# Altium schematic sheet quality&usage_monitor.SchDoc
size A2
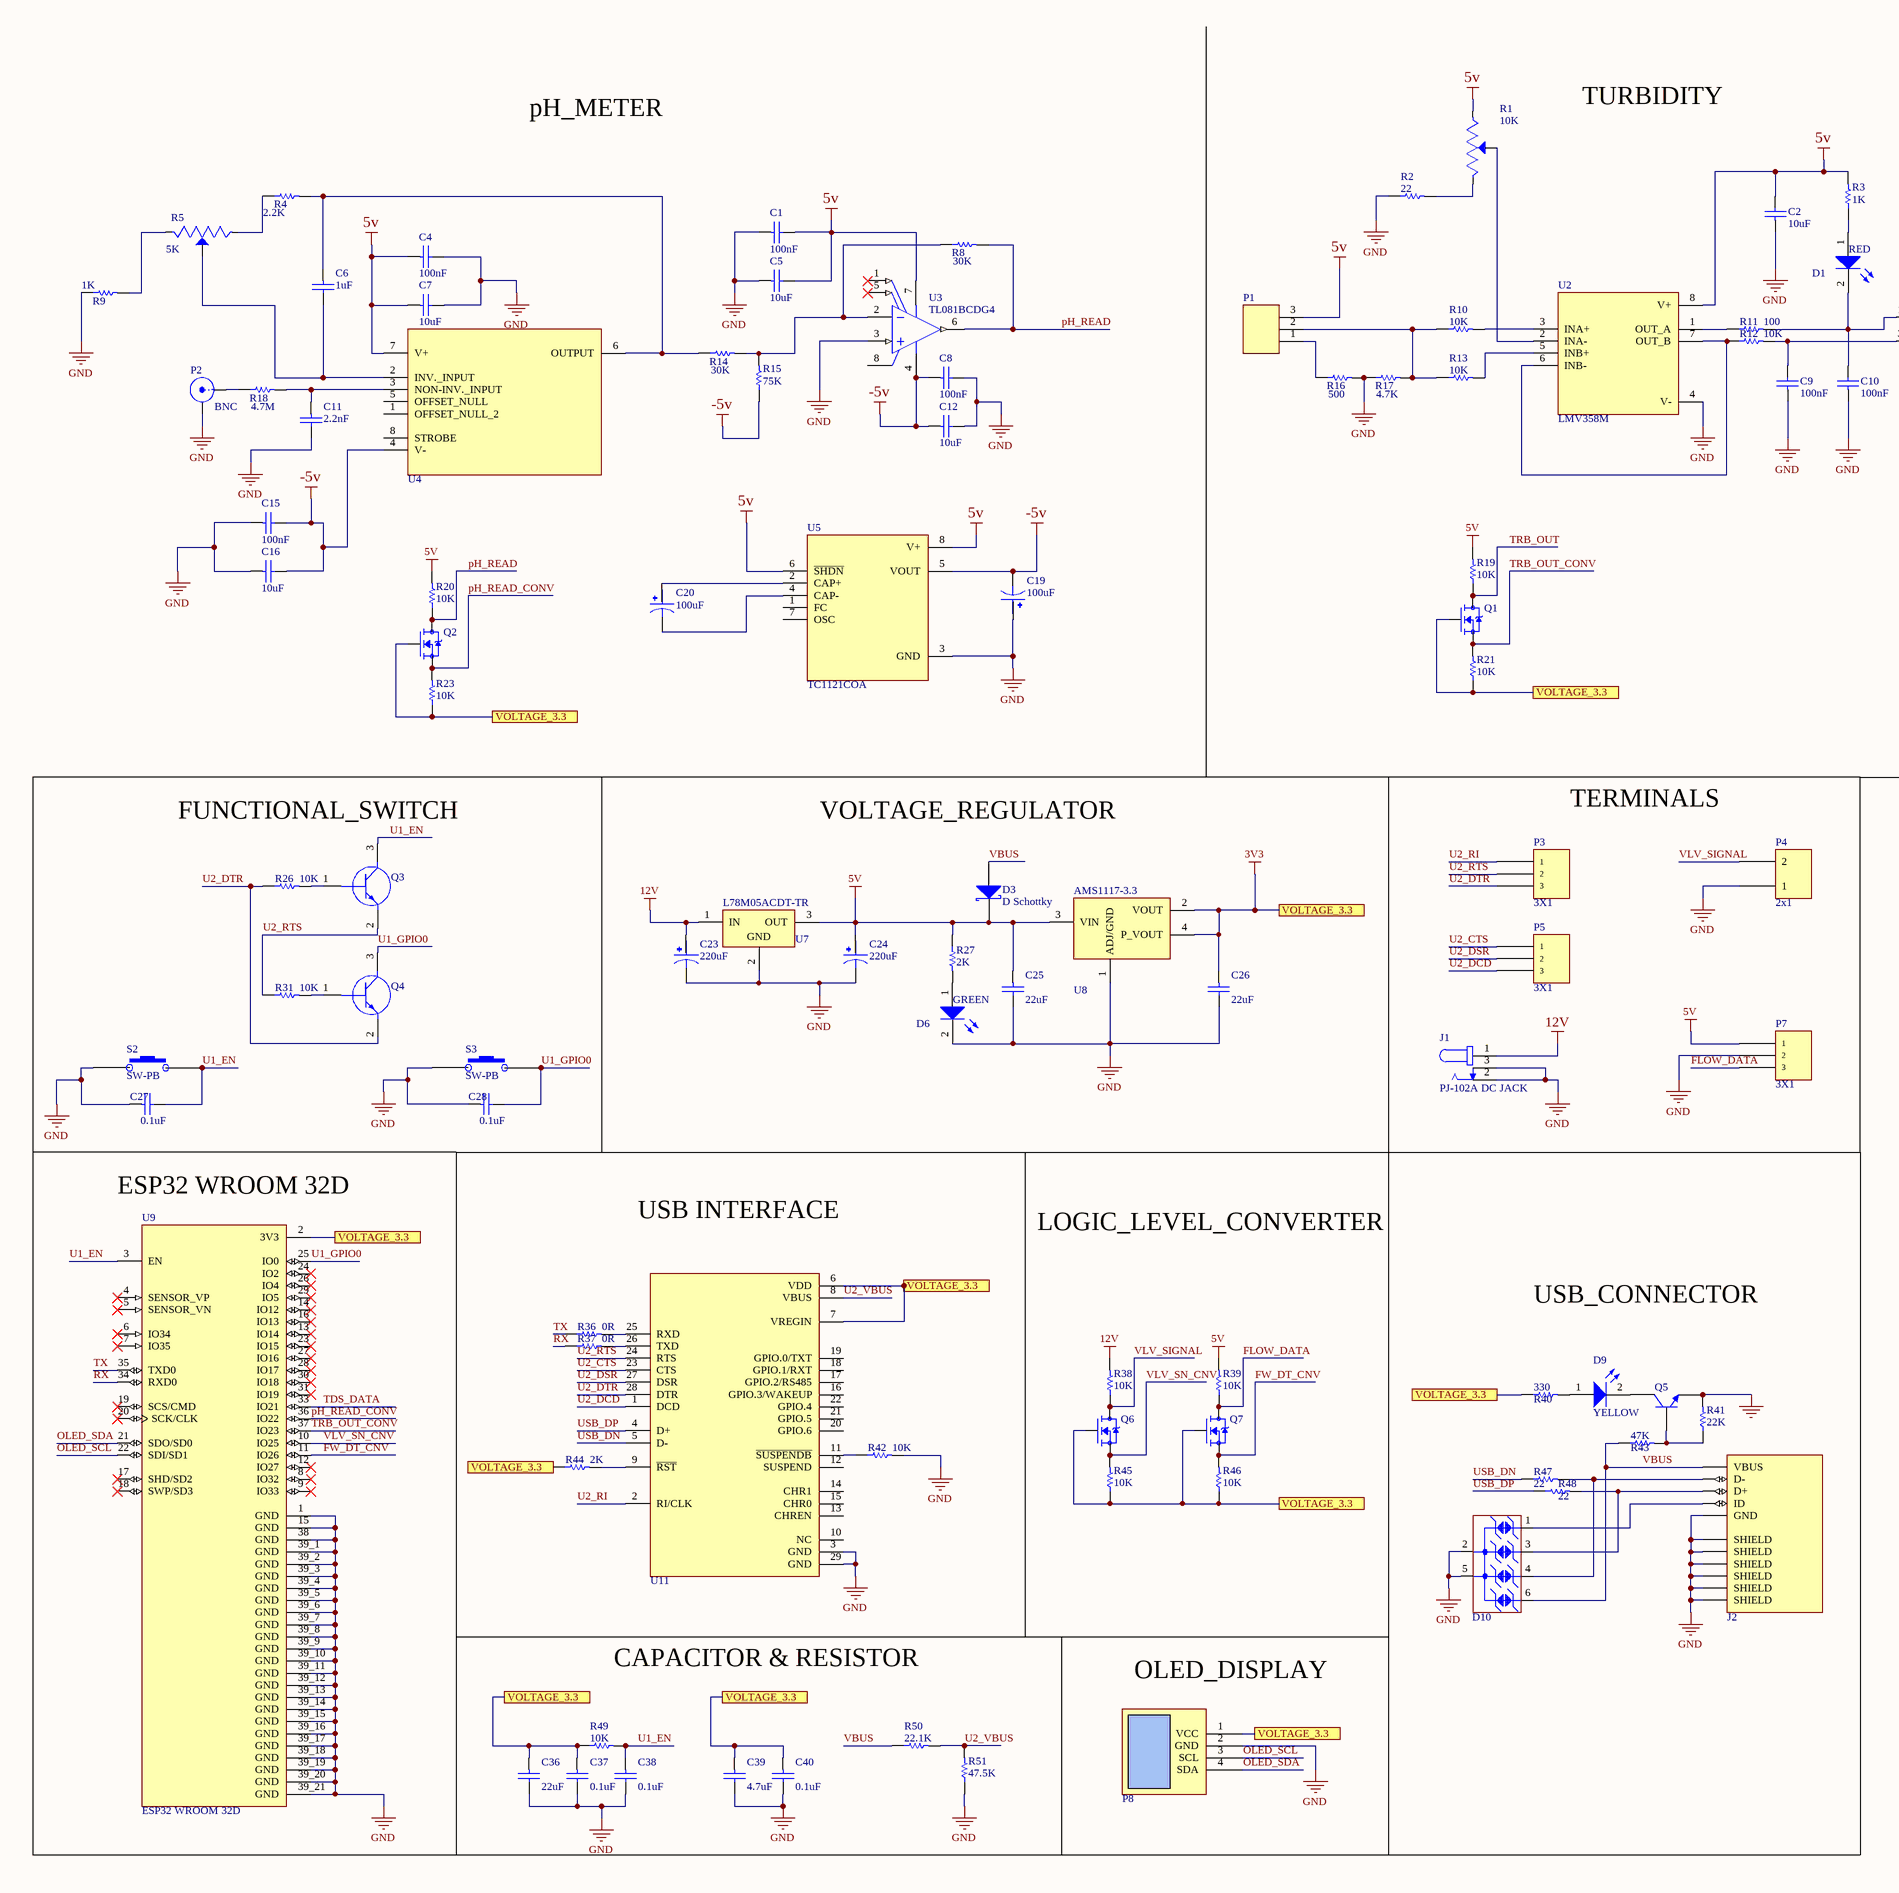
[diagram p0: quality&usage_monitor.SchDoc, left]
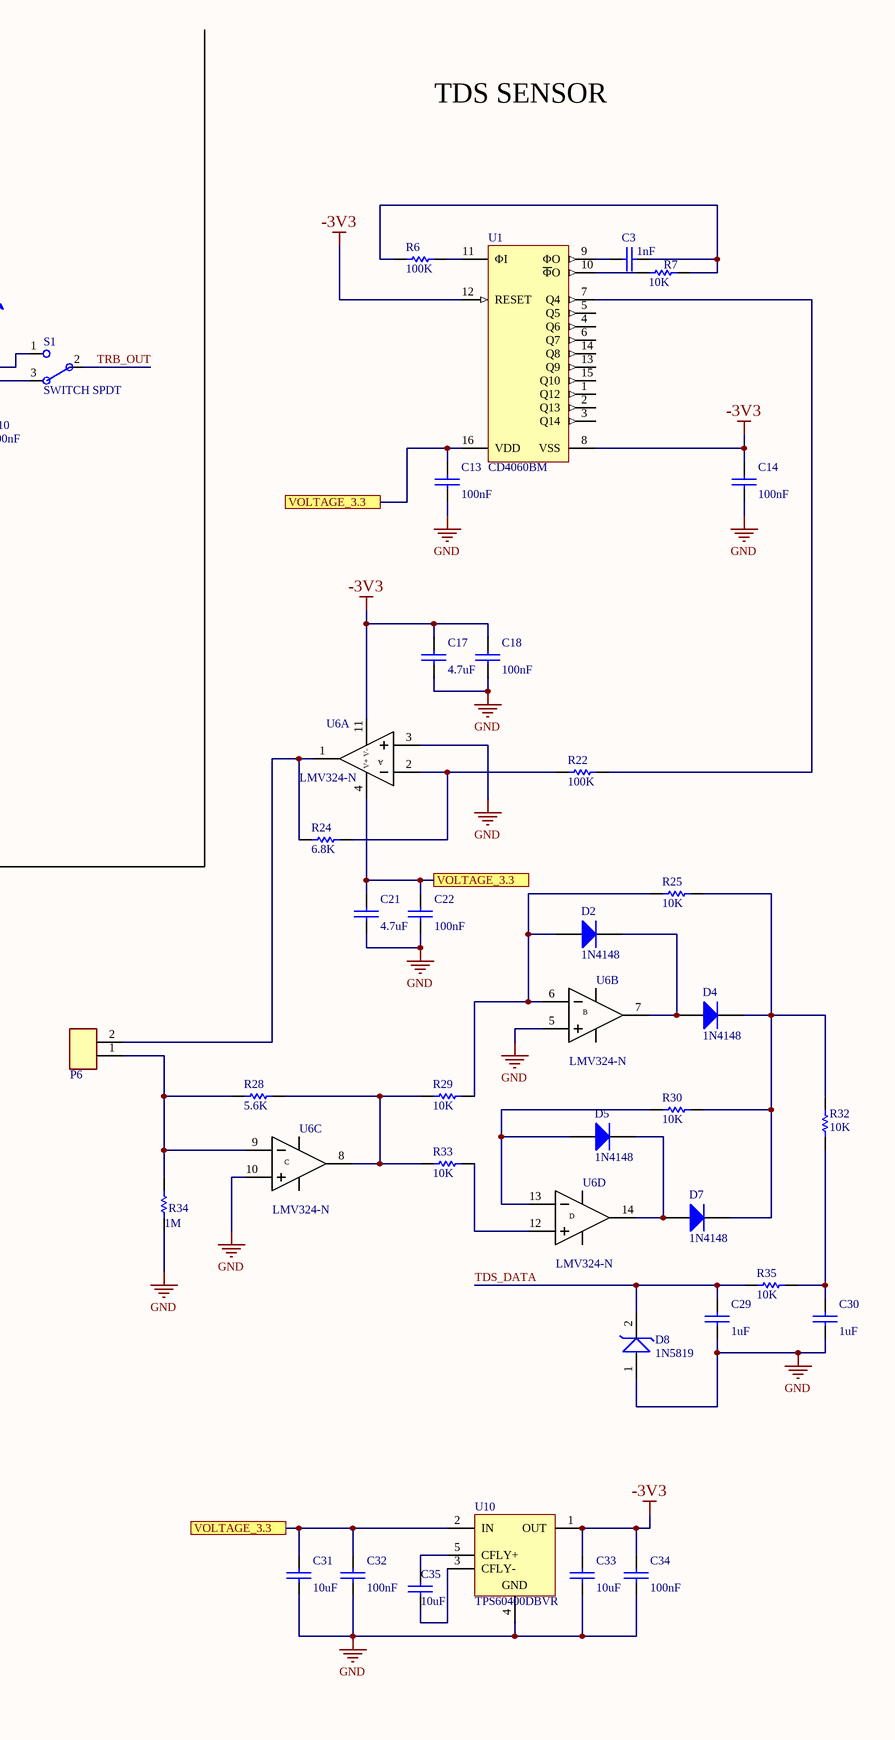
[diagram p1: quality&usage_monitor.SchDoc, right]

## Parts
C1  100nF  [CAPACITOR SMD]
C2  10uF  [CAPACITOR SMD]
C3  1nF  [CAPACITOR SMD]
C4  100nF  [CAPACITOR SMD]
C5  10uF  [CAPACITOR SMD]
C6  1uF  [CAPACITOR SMD]
C7  10uF  [CAPACITOR SMD]
C8  100nF  [CAPACITOR SMD]
C9  100nF  [CAPACITOR SMD]
C10  100nF  [CAPACITOR SMD]
C11  2.2nF  [CAPACITOR SMD]
C12  10uF  [CAPACITOR SMD]
C13  100nF  [CAPACITOR SMD]
C14  100nF  [CAPACITOR SMD]
C15  100nF  [CAPACITOR SMD]
C16  10uF  [CAPACITOR SMD]
C17  4.7uF  [CAPACITOR SMD]
C18  100nF  [CAPACITOR SMD]
C19  100uF  [TAJC226K025RNJ]
C20  100uF  [TAJC226K025RNJ]
C21  4.7uF  [CAPACITOR SMD]
C22  100nF  [CAPACITOR SMD]
C23  220uF  [TAJC226K025RNJ]
C24  220uF  [TAJC226K025RNJ]
C25  22uF  [CAPACITOR SMD]
C26  22uF  [CAPACITOR SMD]
C27  0.1uF  [CAPACITOR SMD]
C28  0.1uF  [CAPACITOR SMD]
C29  1uF  [CAPACITOR SMD]
C30  1uF  [CAPACITOR SMD]
C31  10uF  [CAPACITOR SMD]
C32  100nF  [CAPACITOR SMD]
C33  10uF  [CAPACITOR SMD]
C34  100nF  [CAPACITOR SMD]
C35  10uF  [CAPACITOR SMD]
C36  22uF  [CAPACITOR SMD]
C37  0.1uF  [CAPACITOR SMD]
C38  0.1uF  [CAPACITOR SMD]
C39  4.7uF  [CAPACITOR SMD]
C40  0.1uF  [CAPACITOR SMD]
D1  RED  [LED SMD]
D2  1N4148  [DO-35]
D3  D Schottky  [SMB]
D4  1N4148  [DO-35]
D5  1N4148  [DO-35]
D6  GREEN  [LED SMD]
D7  1N4148  [DO-35]
D8  1N5819  [DIODE 1N5819]
D9  YELLOW  [LED SMD]
D10  ESDA6V1BC6  [ESDA6V1BC6]  (value not drawn)
J1  PJ-102A DC JACK  [PJ-102A]
J2  USB B MICRO  [USB3076-XX-X_REVC]  (value not drawn)
P1  S3B-XH-A(LF)(SN) JST  [S3B-XH-A(LF)(SN) JST]  (value not drawn)
P2  BNC  [BNC_RA CON]
P3  3X1  [FEMALE HEADER 3X1]
P4  2x1  [MALE HEADER 2x1]
P5  3X1  [FEMALE HEADER 3X1]
P6  S2B-XH-A(LF)(SN) JST  [S2B-XH-A(LF)(SN) JST]  (value not drawn)
P7  3X1  [MALE HEADER 3X1]
P8  OLED DISPLAY  [OLED DISPLAY]  (value not drawn)
Q1  N CHANNEL FIELD EFFECT TRANSISTOR  [BSS-138]  (value not drawn)
Q2  N CHANNEL FIELD EFFECT TRANSISTOR  [BSS-138]  (value not drawn)
Q3  SS8050-G  [SS8050-G]  (value not drawn)
Q4  SS8050-G  [SS8050-G]  (value not drawn)
Q5  ID  [NPN SOT-23]  (value not drawn)
Q6  N CHANNEL FIELD EFFECT TRANSISTOR  [BSS-138]  (value not drawn)
Q7  N CHANNEL FIELD EFFECT TRANSISTOR  [BSS-138]  (value not drawn)
R1  10K  [3362P-1-103]
R2  22  [RESISTOR SMD]
R3  1K  [RESISTOR SMD]
R4  2.2K  [RESISTOR SMD]
R5  5K  [3362P-1-103]
R6  100K  [RESISTOR SMD]
R7  10K  [RESISTOR SMD]
R8  30K  [RESISTOR SMD]
R9  1K  [RESISTOR SMD]
R10  10K  [RESISTOR SMD]
R11  100  [RESISTOR SMD]
R12  10K  [RESISTOR SMD]
R13  10K  [RESISTOR SMD]
R14  30K  [RESISTOR SMD]
R15  75K  [RESISTOR SMD]
R16  500  [RESISTOR SMD]
R17  4.7K  [RESISTOR SMD]
R18  4.7M  [RESISTOR SMD]
R19  10K  [RESISTOR SMD]
R20  10K  [RESISTOR SMD]
R21  10K  [RESISTOR SMD]
R22  100K  [RESISTOR SMD]
R23  10K  [RESISTOR SMD]
R24  6.8K  [RESISTOR SMD]
R25  10K  [RESISTOR SMD]
R26  10K  [RESISTOR SMD]
R27  2K  [RESISTOR SMD]
R28  5.6K  [RESISTOR SMD]
R29  10K  [RESISTOR SMD]
R30  10K  [RESISTOR SMD]
R31  10K  [RESISTOR SMD]
R32  10K  [RESISTOR SMD]
R33  10K  [RESISTOR SMD]
R34  1M  [RESISTOR SMD]
R35  10K  [RESISTOR SMD]
R36  0R  [RESISTOR SMD]
R37  0R  [RESISTOR SMD]
R38  10K  [RESISTOR SMD]
R39  10K  [RESISTOR SMD]
R40  330  [RESISTOR SMD]
R41  22K  [RESISTOR SMD]
R42  10K  [RESISTOR SMD]
R43  47K  [RESISTOR SMD]
R44  2K  [RESISTOR SMD]
R45  10K  [RESISTOR SMD]
R46  10K  [RESISTOR SMD]
R47  22  [RESISTOR SMD]
R48  22  [RESISTOR SMD]
R49  10K  [RESISTOR SMD]
R50  22.1K  [RESISTOR SMD]
R51  47.5K  [RESISTOR SMD]
S1  SWITCH SPDT  [EG1218]
S2  SW-PB  [PUSH BUTTON 2PIN]
S3  SW-PB  [PUSH BUTTON 2PIN]
U1  CD4060BM  [D0016A_N]
U2  LMV358M  [LMV358M]
U3  TL081BCDG4  [TI-D8_N]
U4  CA3140AMZ  [CA3140AMZ]  (value not drawn)
U5  TC1121COA  [TC1121COA]
U6  LMV324-N  [LMV324]  (parts A,B,C,D of 4)
U7  L78M05ACDT-TR  [L78M05ACDT-TR]
U8  AMS1117-3.3  [AMS1117-3.3]
U9  ESP32 WROOM 32D  [ESP32 WROOM 32D 4MB]
U10  TPS60400DBVR  [TI-DBV5_N]
U11  CP2102N-A01-GQFN28  [CP2102N-A01-GQFN28]  (value not drawn)

## Ports
VOLTAGE_3.3

## Nets
3V3: C13.1 C21.1 C22.1 C26.1 C31.1 C32.1 C36.1 C37.1 C39.1 C40.1 P8.1(VCC) Q1.1(G) Q2.1(G) Q6.1(G) Q7.1(G) R21.1 R23.1 R40.1 R44.1 R45.1 R46.1 R49.1 U1.16(VDD) U6.4(V+) U8.2(VOUT) U8.4(P_VOUT) U9.2(3V3) U10.2(IN) U11.6(VDD) U11.7(VREGIN) ; port VOLTAGE_3.3
5v: C1.2 C2.2 C4.1 C5.2 C7.1 C24.1 C25.1 D3.2(K) P1.3 P7.1 R1.1(CCW) R3.2 R19.2 R20.2 R27.1 R39.2 U2.8(V+) U3.7(VCC+) U4.7(V+) U5.6(~{SHDN}) U5.8(V+) U7.3(OUT) U8.3(VIN)
12V: C23.1 J1.1 R38.2 U7.1(IN)
-3V3: C14.1 C17.1 C18.1 C33.1 C34.1 U1.8(VSS) U1.12(RESET) U6.11(V-) U10.1(OUT)
-5v: C8.1 C12.1 C15.2 C16.2 C19.2 R15.1 U3.4(VCC-) U4.4(V-) U5.5(VOUT)
GND: C1.1 C2.1 C4.2 C5.1 C7.2 C8.2 C9.1 C10.1 C11.2 C12.2 C13.2 C14.2 C15.1 C16.1 C17.2 C18.2 C19.1 C21.2 C22.2 C23.2 C24.2 C25.2 C26.2 C27.1 C28.1 C29.2 C30.2 C31.2 C32.2 C33.2 C34.2 C36.2 C37.2 C38.2 C39.2 C40.2 D6.2(K) D8.1(A) D10.2(IO2) D10.5(IO4) J1.2 J1.3 J2.5(GND) J2.6(SHIELD) J2.7(SHIELD) J2.8(SHIELD) J2.9(SHIELD) J2.10(SHIELD) J2.11(SHIELD) P2.2(Y) P4.1 P7.2 P8.2(GND) Q5.2(E) R2.1 R9.1 R16.2 R17.1 R34.1 R41.2 R42.2 R51.1 S2.2 S3.2 U2.4(V-) U3.3(IN+) U5.3(GND) U6.3(IN+) U6.5(IN+) U6.10(IN+) U7.2(GND) U8.1(ADJ/GND) U9.1(GND) U9.15(GND) U9.38(GND) U9.39_1(GND) U9.39_2(GND) U9.39_3(GND) U9.39_4(GND) U9.39_5(GND) U9.39_6(GND) U9.39_7(GND) U9.39_8(GND) U9.39_9(GND) U9.39_10(GND) U9.39_11(GND) U9.39_12(GND) U9.39_13(GND) U9.39_14(GND) U9.39_15(GND) U9.39_16(GND) U9.39_17(GND) U9.39_18(GND) U9.39_19(GND) U9.39_20(GND) U9.39_21(GND) U10.4(GND) U11.3(GND) U11.29(GND)
FLOW_DATA: P7.3 Q7.3(D) R39.1
FW_DT_CNV: Q7.2(S) R46.2 U9.11(IO26)
OLED_SCL: P8.3(SCL) U9.22(SDI/SD1)
OLED_SDA: P8.4(SDA) U9.21(SDO/SD0)
pH_READ: Q2.3(D) R8.2 R20.1 U3.6(OUT)
pH_READ_CONV: Q2.2(S) R23.2 U9.36(IO22)
RX: R37.1 U9.34(RXD0)
TDS_DATA: C29.1 D8.2(C) R35.2 U9.33(IO21)
TRB_OUT: Q1.3(D) R19.1 S1.2
TRB_OUT_CONV: Q1.2(S) R21.2 U9.37(IO23)
TX: R36.1 U9.35(TXD0)
U1_EN: C27.2 C38.1 Q3.3(C) R49.2 S2.1 U9.3(EN)
U1_GPIO0: C28.2 Q4.3(C) S3.1 U9.25(IO0)
U2_CTS: P5.1 U11.23(CTS)
U2_DCD: P5.3 U11.1(DCD)
U2_DSR: P5.2 U11.27(DSR)
U2_DTR: P3.3 Q4.2(E) R26.1 U11.28(DTR)
U2_RI: P3.1 U11.2(RI/CLK)
U2_RTS: P3.2 Q3.2(E) R31.1 U11.24(RTS)
U2_VBUS: R50.2 R51.2 U11.8(VBUS)
USB_DN: R47.1 U11.5(D-)
USB_DP: R48.1 U11.4(D+)
VBUS: D3.1(A) D10.6(NC) J2.1(VBUS) R43.1 R50.1
VLV_SIGNAL: P4.2 Q6.3(D) R38.1
VLV_SN_CNV: Q6.2(S) R45.2 U9.10(IO25)
NetC3_1: C3.1 U1.9(ΦO)
NetC3_2: C3.2 R6.2 R7.1
NetC6_1: C6.1 R4.2 R14.1 U4.6(OUTPUT)
NetC6_2: C6.2 R5.2(WIPER) U4.2(INV._INPUT)
NetC9_2: C9.2 R12.2 S1.3
NetC10_2: C10.2 D1.2(K) R11.2 S1.1
NetC11_1: C11.1 R18.2 U4.3(NON-INV._INPUT)
NetC20_1: C20.1 U5.2(CAP+)
NetC20_2: C20.2 U5.4(CAP-)
NetC30_1: C30.1 R32.2 R35.1
NetC35_1: C35.1 U10.5(CFLY+)
NetC35_2: C35.2 U10.3(CFLY-)
NetD1_1: D1.1(A) R3.1
NetD2_1: D2.1(A) R25.2 R29.1 U6.6(IN-)
NetD2_2: D2.2(K) D4.1(A) U6.7(OUT)
NetD4_2: D4.2(K) D7.2(K) R25.1 R30.1 R32.1
NetD5_1: D5.1(A) R30.2 U6.13(IN-)
NetD5_2: D5.2(K) D7.1(A) U6.14(OUT)
NetD6_1: D6.1(A) R27.2
NetD9_1: D9.1(A) R40.2
NetD9_2: D9.2(K) Q5.3(C)
NetD10_1: D10.1(IO1) J2.4(ID)
NetD10_3: D10.3(GND) J2.3(D+) R48.2
NetD10_4: D10.4(IO3) J2.2(D-) R47.2
NetP1_1: P1.1 R16.1
NetP1_2: P1.2 R10.1 R13.1 R17.2
NetP2_1: P2.1(X) R18.1
NetP6_1: P6.1 R28.2 R34.2 U6.9(IN-)
NetP6_2: P6.2 R24.2 U6.1(OUT)
NetQ3_1: Q3.1(B) R26.2
NetQ4_1: Q4.1(B) R31.2
NetQ5_1: Q5.1(B) R41.1 R43.2
NetR1_2: R1.2(WIPER) U2.2(INA-)
NetR1_3: R1.3(CW) R2.2
NetR4_1: R4.1 R5.1(CCW)
NetR5_3: R5.3(CW) R9.2
NetR6_1: R6.1 U1.11(ΦI)
NetR7_2: R7.2 U1.10(~{Φ}O)
NetR8_1: R8.1 R14.2 R15.2 U3.2(IN-)
NetR10_2: R10.2 U2.3(INA+)
NetR11_1: R11.1 U2.1(OUT_A)
NetR12_1: R12.1 U2.6(INB-) U2.7(OUT_B)
NetR13_2: R13.2 U2.5(INB+)
NetR22_1: R22.1 U1.7(Q4)
NetR22_2: R22.2 R24.1 U6.2(IN-)
NetR28_1: R28.1 R29.2 R33.2 U6.8(OUT)
NetR33_1: R33.1 U6.12(IN+)
NetR36_2: R36.2 U11.25(RXD)
NetR37_2: R37.2 U11.26(TXD)
NetR42_1: R42.1 U11.11(~{SUSPENDB})
NetR44_2: R44.2 U11.9(~{RST})

Not connected (* = marked no-connect by the designer): U1 1(Q12) 2(Q13) 3(Q14) 4(Q6) 5(Q5) 6(Q7) 13(Q9) 14(Q8) 15(Q10); U3 1(OFFSET_N1)* 5(OFFSET_N2)* 8(NC); U4 1(OFFSET_NULL_2) 5(OFFSET_NULL) 8(STROBE); U5 1(FC) 7(OSC); U9 4(SENSOR_VP)* 5(SENSOR_VN)* 6(IO34)* 7(IO35)* 8(IO32)* 9(IO33)* 12(IO27)* 13(IO14)* 14(IO12)* 16(IO13)* 17(SHD/SD2)* 18(SWP/SD3)* 19(SCS/CMD)* 20(SCK/CLK)* 23(IO15)* 24(IO2)* 26(IO4)* 27(IO16)* 28(IO17)* 29(IO5)* 30(IO18)* 31(IO19)*; U11 10(NC) 12(SUSPEND) 13(CHREN) 14(CHR1) 15(CHR0) 16(GPIO.3/WAKEUP) 17(GPIO.2/RS485) 18(GPIO.1/RXT) 19(GPIO.0/TXT) 20(GPIO.6) 21(GPIO.5) 22(GPIO.4)

## Notes on the sheet
- TDS SENSOR
- pH_METER
- TURBIDITY
- (near Q3) FUNCTIONAL_SWITCH
- VOLTAGE_REGULATOR
- TERMINALS
- (near U9) ESP32 WROOM 32D
- USB INTERFACE
- LOGIC_LEVEL_CONVERTER
- USB_CONNECTOR
- CAPACITOR & RESISTOR
- OLED_DISPLAY
- (in symbol LMV324-N, part A) A
- (in symbol LMV324-N, part B) B
- (in symbol LMV324-N, part C) C
- (in symbol LMV324-N, part D) D

## Library data of the parts
C1 C2 C4-C12 C15 C16 = CAPACITOR SMD
C3 C13 C14 C17 C18 C21 C22 C25-C40 = CAPACITOR SMD: CAPACITOR
C19 C20 C23 C24 = TAJC226K025RNJ: Tantalum Capacitors
D1 D6 D9 = LED: SMD COMPONENT, Typical RED, GREEN, YELLOW, AMBER GaAs LED
D2 D4 D5 D7 = Diode 1N4148: High Conductance Fast Diode; Published: 8-Jun-2000; LatestRevisionDate: 17-Jul-2002; LatestRevisionNote: Re-released for DXP Platform.; DatasheetVersion: 1997; PackageReference: DO-35; Publisher: Altium Limited; PackageDescription: Diode, Axial; Body 3.8 x 1.9 mm (LxDia. max), Lead Dia. 0.53 mm (max); Code_JEDEC: DO-204-AH; ComponentLink1Description: Manufacturer Link; ComponentLink1URL: http://www.fairchildsemi.com/; ComponentLink2Description: Datasheet; ComponentLink2URL: http://www.fairchildsemi.com/ds/1N%2F1N4148.pdf
D3 = D Schottky: Schottky Diode; Published: 8-Jun-2000; LatestRevisionDate: 17-Jul-2002; LatestRevisionNote: Re-released for DXP Platform.; PackageReference: SMB; Publisher: Altium Limited; PackageDescription: DO-214-AA/SMB; 2 C-Bend Leads; Body 5.3 x 3.6 mm, inc. leads (LxW); Code_JEDEC: DO-214-AA
D8 = DIODE 1N5819: Diode Schottky 40V 1A Through Hole DO-41
D10 = ESDA6V1BC6: ESD PROTECTION
J1 = PJ-102A DC JACK: 2.0 x 6.5 mm, 2.5 A, Horizontal, Through Hole, Tapered Pins, Dc Power Jack Connector
J2 = USB3076-XX-X_REVC: USB INTERFACE
P1 = S3B-XH-A(LF)(SN) JST: Conn Shrouded Header (4 Sides) HDR 3 POS 2.5mm
P2 = BNC: BNC Elbow Connector; LatestRevisionDate: 17-Jul-2002; LatestRevisionNote: Re-released for DXP Platform.; Publisher: Altium Limited
P3 P5 P7 = HEADER 3X1: 2.54 mm Male/Female Header
P4 = HEADER 2X1: 2.54 mm Male/Female Header
P6 = S2B-XH-A(LF)(SN) JST: Connector Header Through Hole, Right Angle 2 position 0.098" (2.50mm)
P8 = OLED DISPLAY: 0.96" OLED display 4 pin
Q1 Q2 Q6 Q7 = BSS-138: MOSFET
Q3 Q4 = SS8050-G: Bipolar (BJT) Transistor NPN 25 V 1.5 A 100MHz 300 mW Surface Mount SOT-23-3
Q5 = NPN TRANSISTOR: NPN Bipolar Transistor
R1 R5 = TRIMMER POTENTIOMETER: VARIABLE RESISTOR
R2-R4 R6-R51 = RESISTOR SMD: Resistor,12K1,0603,1%,VISHAY
S1 = SWITCH SPDT: EG1218 SWITCH SLIDE SPDT 200MA 30V
S2 S3 = PUSH BUTTON 2PIN: 2 PIN- 5 mm
U1 = CD4060BM: CMOS 14-Stage Ripple-Carry Binary Counter/Divider and Oscillator, D0016A, TUBE; Manufacturer: Texas Instruments; VCC(Max)(V): 18; VCC(Min)(V): 3; Inputs: 1; ICC @ Nom Voltage(Max)(mA): 0.03; Bits(#): 10; F @ Nom Voltage(Max)(Mhz): 8; Rating: Military; Technology Family: CD4000; Schmitt Trigger: No; Output Drive (IOL/IOH)(Max)(mA): 1.5/-1.5; tpd @ Nom Voltage(Max)(ns): 300; DatasheetVersion: SCHS049C; PackageReference: D0016A; Supplier 1: Mouser; Supplier Part Number 1: 595-CD4060BM; Supplier 2: Digi-Key; Supplier Part Number 2: 296-32902-5-ND; Generic Part Number: CD4060B; Output Type: CMOS; Function: Counter; Input Type: CMOS; Operating Temperature Range(C): -55 to 125; Type: Binary; Voltage(Nom)(V): 10; Code_JEDEC: MS-012 variation AC; PartNumber: CD4060BM; ComponentLink1Description: Manufacturer URL; ComponentLink1URL: http://www.ti.com/; ComponentLink2Description: Datasheet; ComponentLink2URL: http://www.ti.com/lit/ds/symlink/cd4060b.pdf; ComponentLink3Description: Package Specification; ComponentLink3URL: http://www.ti.com/lit/ml/mpds178g/mpds178g.pdf
U2 = LMV358M: General Purpose, Low Voltage, Rail-to-Rail Output Operational Amplifiers 8-SOIC -40 to 125
U3 = TL081BCDG4: JFET-Input Operational Amplifier, 7 to 36 V, 0 to 70 degC, 8-pin SOIC (D8), Green (RoHS & no Sb/Br); Manufacturer: Texas Instruments; CMRR(Min)(dB): 75; GBW(Typ)(MHz): 3; IIB(Max)(pA): 200; Iq per channel(Max)(mA): 2.8; Number of Channels: 1; Offset Drift(Typ)(uV/C): 18; Rating: Catalog; Slew Rate(Typ)(V/us): 13; Sub Family: General Purpose Amplifier, High Supply Voltage Amplifier (>=30V); Total Supply Voltage(Max)(+5V is 5, +/-5V is 10): 36; Total Supply Voltage(Min)(+5V is 5, +/-5V is 10): 7; DatasheetVersion: SLOS081G; PackageVersion: 4040047-3/M, 06/2011; PackageReference: D8; PackageDescription: 8-Pin Plastic Small Outline, Body 4.9 x 3.9 mm, Pitch 1.27 mm; Supplier 1: Digi-Key; Supplier Part Number 1: TL081BCDG4-ND; Supplier 2: Mouser; Supplier Part Number 2: 595-TL081BCDG4; Eco-Plan: Green (RoHS & no Sb/Br); Vio (25C)(Max)(mV): 3; Vn at 1kHz(Typ)(nV/rtHz): 18; Mounting Technology: Surface Mount; Code_JEDEC: MS-012; PartNumber: TL081BCDG4; ComponentLink1Description: Manufacturer URL; ComponentLink1URL: http://www.ti.com/; ComponentLink2Description: Datasheet; ComponentLink2URL: http://www.ti.com/lit/ds/symlink/tl081b.pdf; ComponentLink3Description: Package Specification; ComponentLink3URL: http://www.ti.com/litv/pdf/msoi002j
U4 = CA3140AMZ: General Purpose Amplifier 1 Circuit - 8-SOIC
U5 = TC1121COA: Charge Pump Switching Regulator IC Negative Fixed -Vin 1 Output 100mA 8-SOIC (0.154", 3.90mm Width)
U6 = LMV324-N: ON Semiconductor LV R2R OPAMPK; Mfr_Name: Texas Instruments; Manufacturer_Part_Number: LMV324-N_D_14; PartNumber: LMV324M; Manufacturer: NationalSemiconductor; Characteristics: LMV324MGeneralPurposeLowVoltageR-ROut1MHzQuadOpAmp; CompType: OpAmpIC; TaMin_C: -400; TaMax_C: 850; ComponentLink1DescBC: LMV324Datasheet; ComponentLink2DescA4: LMV324WebPage; ComponentLink3DescAC: M14APackageWebPage; Copyright: Copyright (C) 2021 Ultra Librarian. All rights reserved.; RefDes: RefDes; Type: DEV; SymbolVersion: 2008-07-09; PackageDescription: 14LeadSOIC; PackageReference: M14A_L; RoHS: O; ComponentLink1URL: http//wwwnationalcom/ds/LM/LMV324pdf; ComponentLink2URL: http//wwwnationalcom/pf/LM/LMV324html; ComponentLink3URL: http//wwwnationalcom/packaging/folders/m14ahtml; Version: B1608; LatestRevisionDate: 2009-03-16; LatestRevisionNote: MassUpdate; Publisher: NationalSemiconductor; Published: 2009-03-16
U7 = L78M05ACDT-TR: Linear Voltage Regulator IC Positive Fixed 1 Output 500mA DPAK
U8 = AMS1117-3.3: VOLTAGE REGULATOR INPUT-5V;OUTPUT-3V3
U9 = ESP32 WROOM 32D: 39 PIN RX TXRX MOD WIFI TRACE ANT SMD
U10 = TPS60400DBVR: -1.8 to -5.25 V, Inverting Charge Pump, 60 mA, 1.8 to 5.25 V Input with 2-Cell Alkaline / Nixx Input, -40 to 85 degC, 5-pin SOT23 (DBV5), Green (RoHS & no Sb/Br); Manufacturer: Texas Instruments; 2-Cell Alkaline/Nixx Input: TRUE; Efficiency(Typ)(%): 99; Iout(Max)(A): 0.06; Iq(Typ)(mA): 0.125; Switching Frequency(Max)(kHz): 450; Topology: Inverting Buck/Boost; Vin(Max)(V): 5.25; Vin(Min)(V): 1.8; Vout(Min)(V): -1.6; DatasheetVersion: SLVS324A; PackageVersion: 4073253-4/K; PackageReference: DBV5; PackageDescription: 5-Pin Plastic Small Outline, Body 1.60 Ã— 2.90 mm, Pitch 0.95 mm; Supplier 1: Digi-Key; Supplier Part Number 1: 296-27004-2-ND; Supplier 2: Digi-Key; Supplier Part Number 2: 296-27004-1-ND; Supplier 3: Digi-Key; Supplier Part Number 3: 296-27004-6-ND; Supplier 4: Newark; Supplier Part Number 4: 77C0625; Supplier 5: Mouser; Supplier Part Number 5: 595-TPS60400DBVR; Eco-Plan: Green (RoHS & no Sb/Br); Vout(Max)(V): -5.25; Mounting Technology: Surface Mount; Code_JEDEC: MO-178; PartNumber: TPS60400DBVR; ComponentLink1Description: Manufacturer URL; ComponentLink1URL: http://www.ti.com/; ComponentLink2Description: Datasheet; ComponentLink2URL: http://www.ti.com/general/docs/lit/getliterature.tsp?genericPartNumber=TPS60400&fileType=pdf; ComponentLink3Description: Package Specification; ComponentLink3URL: http://www.ti.com/litv/pdf/mpds018i
U11 = CP2102N-A01-GQFN28: USB BRIDGE, USB to UART USB 2.0 UART INTERFACE 28-QFN